# Altium schematic sheet PowerModule.SchDoc: CAN Current Loop Module - Power
size A4; Author: Pablo R Nava; DrawnBy: Pablo R Nava; Engineer: Pablo R Nava
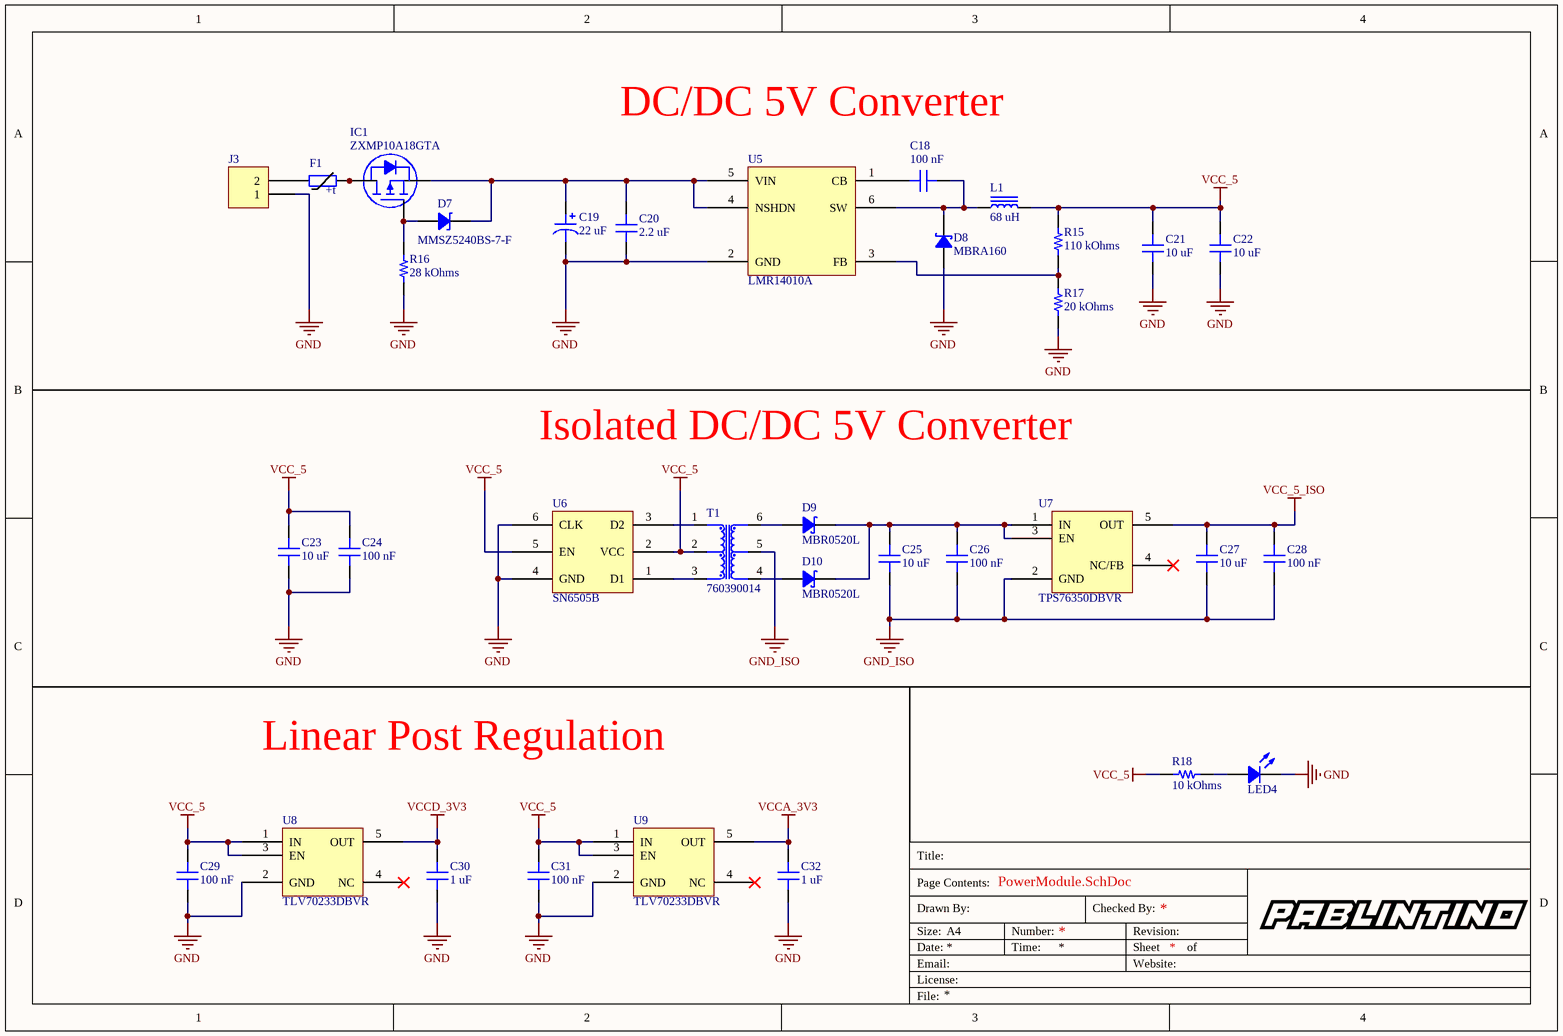
[diagram p0: PowerModule.SchDoc]

## Parts
C18  100 nF  [CAP 0805_2012]
C19  22 uF  [CAP ALSMD 6.3MM H7.7MM]
C20  2.2 uF  [CAP 1206_3216 - 1.8MM]
C21  10 uF  [CAP 1206_3216 - 1.8MM]
C22  10 uF  [CAP 1206_3216 - 1.8MM]
C23  10 uF  [CAP 0805_2012]
C24  100 nF  [CAP 0805_2012]
C25  10 uF  [CAP 0805_2012]
C26  100 nF  [CAP 0805_2012]
C27  10 uF  [CAP 0805_2012]
C28  100 nF  [CAP 0603_1608]
C29  100 nF  [CAP 0603_1608]
C30  1 uF  [CAP 0805_2012]
C31  100 nF  [CAP 0603_1608]
C32  1 uF  [CAP 0805_2012]
D7  MMSZ5240BS-7-F  [SOD-123]
D8  MBRA160  [DO214AC SMA]
D9  MBR0520L  [SOD-123]
D10  MBR0520L  [SOD-123]
F1  NANOASMDC012F-2  [PPTC_1206_1MM]  (value not drawn)
IC1  ZXMP10A18GTA  [DIODES SOT-223]
J3  1757475  [MSTBA2]  (value not drawn)
L1  68 uH  [SRR1210]
LED4  APTD1608LSECK  [LED 0603_1608 RED]  (value not drawn)
R15  110 kOhms  [RES 0805_2012]
R16  28 kOhms  [RES 0805_2012]
R17  20 kOhms  [RES 0805_2012]
R18  10 kOhms  [RES 0603_1608]
T1  760390014  [WE7603900XX]
U5  LMR14010A  [TI SOT-23-6 DDC]
U6  SN6505B  [TI SOT-23-6 DBV]
U7  TPS76350DBVR  [TI SOT-23-5 DBV]
U8  TLV70233DBVR  [TI SOT-23-5 DBV]
U9  TLV70233DBVR  [TI SOT-23-5 DBV]

## Nets
GND: C19.2 C20.2 C21.2 C22.2 C23.2 C24.2 C29.2 C30.2 C31.2 C32.2 D8.1 J3.1 LED4.2 R16.1 R17.2 U5.2(GND) U6.4(GND) U6.6(CLK) U8.2(GND) U9.2(GND)
GND_ISO: C25.2 C26.2 C27.2 C28.2 T1.5 U7.2(GND)
VCC_5: C21.1 C22.1 C23.1 C24.1 C29.1 C31.1 L1.2 R15.1 R18.1 T1.2 U6.2(VCC) U6.5(EN) U8.1(IN) U8.3(EN) U9.1(IN) U9.3(EN)
VCC_5_ISO: C27.1 C28.1 U7.5(OUT)
VCCA_3V3: C32.1 U9.5(OUT)
VCCD_3V3: C30.1 U8.5(OUT)
NetC18_1: C18.1 D8.2 L1.1 U5.6(SW)
NetC18_2: C18.2 U5.1(CB)
NetC19_1: C19.1 C20.1 D7.2 IC1.3(S) U5.4(NSHDN) U5.5(VIN)
NetC25_1: C25.1 C26.1 D9.2 D10.2 U7.1(IN) U7.3(EN)
NetD7_1: D7.1 IC1.1(G) R16.2
NetD9_1: D9.1 T1.6
NetD10_1: D10.1 T1.4
NetF1_1: F1.1 J3.2
NetF1_2: F1.2 IC1.2(D) IC1.4(D)
NetLED4_1: LED4.1 R18.2
NetR15_2: R15.2 R17.1 U5.3(FB)
NetT1_1: T1.1 U6.3(D2)
NetT1_3: T1.3 U6.1(D1)

Not connected (* = marked no-connect by the designer): U7 4(NC/FB)*; U8 4(NC)*; U9 4(NC)*

## Notes on the sheet
- DC/DC 5V Converter
- Isolated DC/DC 5V Converter
- Linear Post Regulation
- Title:
- Drawn By:
- Page Contents:
- Checked By:
- Size:
- Date:
- File:
- License:
- Email:
- A4
- Number:
- Time:
- Revision:
- Sheet
- Website:
- of
- (in symbol NANOASMDC012F-2) +t

## Library data of the parts
C18 = 08055C104K4Z2A: MLCC Ceramic 100 nF 50 V 10% Capacitor; Manufacturer: AVX; Voltage: 50 V; Type: capacitor_ceramic; Through Hole: 0; Part Number: 08055C104K4Z2A; Value: 100 nF; Tolerance: 10%; Composition: X7R; Created On: 30/05/2020 9:36:24; Updated On: 30/05/2020 9:36:39; Package: 0805 (2012 Metric)
C19 = HHXA630ARA220MF80G: Aluminum Electrolytic 22 uF 63 V 20% Capacitor; Manufacturer: United Chemi-Con; Voltage: 63 V; Material: aluminium; Polarised: 1; ESR: 80 mOhms; Lifetime Temperature: 4000 Hours @ 125 ºC; Minimum Temperature: 125 ºC; Maximum Temperature: -55 ºC; Type: capacitor_electrolytic; Through Hole: 0; Part Number: HHXA630ARA220MF80G; Value: 22 uF; Tolerance: 20%; Created On: 03/08/2020 11:19:58; Updated On: 03/08/2020 14:04:34; Package: SMD
C20 = 12065C225K4T2A: MLCC Ceramic 2.2 uF 50 V 10% Capacitor; Manufacturer: AVX; Voltage: 50 V; Type: capacitor_ceramic; Through Hole: 0; Part Number: 12065C225K4T2A; Value: 2.2 uF; Tolerance: 10%; Composition: X7R; Created On: 18/08/2020 12:44:20; Updated On: 18/08/2020 12:44:32; Package: 1206 (3216 Metric)
C21 C22 = 1206YC106KAT2A: MLCC Ceramic 10 uF 16 V 10% Capacitor; Manufacturer: AVX; Voltage: 16 V; Type: capacitor_ceramic; Through Hole: 0; Part Number: 1206YC106KAT2A; Value: 10 uF; Tolerance: 10%; Composition: X7R; Created On: 18/08/2020 12:31:56; Updated On: 18/08/2020 12:32:34; Package: 1206 (3216 Metric)
C23 C25 C27 = 0805YC106MAT2A: MLCC Ceramic 10 uF 25 V 20% Capacitor; Manufacturer: AVX; Voltage: 16 V; Type: capacitor_ceramic; Through Hole: 0; Part Number: 0805YC106MAT2A; Value: 10 uF; Tolerance: 20%; Composition: X7R; Created On: 22/06/2020 21:37:18; Updated On: 22/06/2020 21:37:31; Package: 0805 (2012 Metric)
C24 C26 = 0805YC104KAT4A: MLCC Ceramic 100 nF 16 v 10% Capacitor; Manufacturer: AVX; Voltage: 16 V; Type: capacitor_ceramic; Through Hole: 0; Part Number: 0805YC104KAT4A; Value: 100 nF; Tolerance: 10%; Composition: X7R; Created On: 21/05/2020 21:26:42; Updated On: 21/05/2020 21:29:08; Package: 0805 (2012 Metric)
C28 C29 C31 = 0603YC104KAT2A: MLCC Ceramic 100 nF 16 V 10% Capacitor; Manufacturer: AVX; Voltage: 16 V; Type: capacitor_ceramic; Through Hole: 0; Part Number: 0603YC104KAT2A; Value: 100 nF; Tolerance: 10%; Composition: X7R; Created On: 22/07/2020 19:09:12; Updated On: 22/07/2020 19:10:15; Package: 0603 (1608 Metric)
C30 C32 = 0805YC105KAT4A: MLCC Ceramic 1 uF 16 V 10% Capacitor; Manufacturer: AVX; Voltage: 16 V; Type: capacitor_ceramic; Through Hole: 0; Part Number: 0805YC105KAT4A; Value: 1 uF; Tolerance: 10%; Composition: X7R; Created On: 18/07/2020 20:46:26; Updated On: 18/07/2020 20:46:47; Package: 0805 (2012 Metric)
D7 = MMSZ5240BS-7-F: Zener 200 mW 10 V; Manufacturer: Diodes Incorporated; Maximum Power: 200 mW; Forward Voltage: 0.9 V; Zener Voltage: 10 V; Type: diode_zener; Through Hole: 0; Part Number: MMSZ5240BS-7-F; Created On: 19/07/2020 12:49:44; Updated On: 19/07/2020 13:00:21; Package: SOD-323-2
D8 = MBRA160: Schottky Rectifier Diode; Manufacturer: ON Semiconductor; Forward Voltage: 0.510 V; Reverse Leakage Current: 0.2 mA; Maximum Forward Avg. Current: 1 A; Maximum Repetitive Reverse Voltage: 60 V; Type: diode_rectifier; Through Hole: 0; Part Number: MBRA160; Diode Type: schottky; Created On: 02/08/2020 21:52:05; Updated On: 02/08/2020 21:57:57; Package: SMA 403D
D9 D10 = MBR0520L: Schottky Rectifier Diode; Manufacturer: ON Semiconductor; Forward Voltage: 0.385 V; Reverse Leakage Current: 8 mA; Maximum Forward Avg. Current: 500 mA; Maximum Repetitive Reverse Voltage: 20 V; Type: diode_rectifier; Through Hole: 0; Part Number: MBR0520L; Diode Type: schottky; Created On: 02/08/2020 21:34:39; Updated On: 02/08/2020 21:35:15; Package: SOD-123
F1 = NANOASMDC012F-2: PPTC .12A 48V Nano SMD AEC-Q200; Manufacturer: Littelfuse; Hold Current: 120 mA; Trip Current: 390 mA; Maximum Resistance: 1.5 Ohms; Minimum Resistance: 6.5 Ohms; Power Rating: 500 mW; Current Rating: 10 A; Type: fuse_pptc; Through Hole: 0; Part Number: NANOASMDC012F-2; Voltage Rating: 48 V; Created On: 07/08/2020 10:13:16; Updated On: 18/08/2020 22:26:58; Package: 1206 (3216 Metric)
IC1 = ZXMP10A18GTA: MOSFET 100V P-Chnl UMOS; Manufacturer: Diodes Incorporated; Drain Source Resistance: 150 mOhms; Gate Source Max Voltage: 20 V; Gate Source Threshold Voltage: 2 V; Drain Source Max Current: 3.7 A; Maximum Power: 3.9 W; Channel Type: P-Channel; Through Hole: 0; Part Number: ZXMP10A18GTA; Drain Source Max Voltage: 100 V; Created On: 19/07/2020 8:37:51; Updated On: 19/07/2020 11:20:23; Type: transistor_mosfet; Package: SOT-223-4
J3 = 1757475: Pluggable Terminal Blocks 2 Pos 5mm pitch Through Hole Header; Manufacturer: Phoenix Contact; Voltage Rating: 250 V; Current Rating: 12 A; Number of Contacts: 2; Through Hole: 1; LatestRevisionDate: 17-Jul-2002; LatestRevisionNote: Re-released for DXP Platform.; Publisher: Altium Limited; Part Number: 1757475; Orientation: right; Pitch: 5 mm; Number of Rows: 1; Created On: 18/07/2020 15:45:14; Updated On: 18/07/2020 15:45:51; Type: connector_pcb; Package: Through Hole
L1 = SRR1210-680M: Shielded SMD Power Inductor 68 uH 3 A; Manufacturer: Bourns; Resistance DCR: 102 mOhms; Test Frequency: 2.52 MHz; Current Rating: 3 A; Current Saturation: 2.7 A; Tolerance: 20%; Type: power_inductor; Through Hole: 0; Part Number: SRR1210-680M; Value: 68 uH; Created On: 02/08/2020 17:46:05; Updated On: 02/08/2020 21:10:00; Package: SRR1210
LED4 = APTD1608LSECK: SMD Low Current Red LED; Manufacturer: Kingbright; Gain Bandwith Product: 1.8 V; Input Type: dome; Amplifier Type: clear; Slew Rate: 625 nm; Voltage Supplies: 2 mA; Input Offset Voltage: 0.8 mm x 1.2 mm; Type: led_indicator; Through Hole: 0; Part Number: APTD1608LSECK; Output Type: red; Created On: 28/07/2020 18:43:03; Updated On: 28/07/2020 18:43:38; Package: 0603 (1608 Metric)
R15 = CRCW0805110KFKEAC: Thin Film Resistor 110 kOhms 1%; Manufacturer: Vishay / Dale; Power Max: 125 mW; Through Hole: 0; Part Number: CRCW0805110KFKEAC; Value: 110 kOhms; Tolerance: 1%; Created On: 18/08/2020 11:17:49; Updated On: 18/08/2020 11:18:12; Type: resistor; Package: 0805 (2012 Metric)
R16 = CRCW080528K0FKEA: Thin Film Resistor 28 kOhms 1%; Manufacturer: Vishay / Dale; Power Max: 125 mW; Through Hole: 0; Part Number: CRCW080528K0FKEA; Value: 28 kOhms; Tolerance: 1%; Created On: 19/07/2020 13:06:42; Updated On: 19/07/2020 13:07:02; Type: resistor; Package: 0805 (2012 Metric)
R17 = CRCW080520K0FKEAC: Thin Film Resistor 20 kOhms 1%; Manufacturer: Vishay / Dale; Power Max: 125 mW; Through Hole: 0; Part Number: CRCW080520K0FKEAC; Value: 20 kOhms; Tolerance: 1%; Created On: 18/08/2020 11:20:59; Updated On: 18/08/2020 11:21:05; Type: resistor; Package: 0805 (2012 Metric)
R18 = CRCW060310K0FKEAC: Thin Film Resistor 10 kOhms 1%; Manufacturer: Vishay / Dale; Power Max: 100 mW; Through Hole: 0; Part Number: CRCW060310K0FKEAC; Value: 10 kOhms; Tolerance: 1%; Created On: 22/07/2020 22:08:22; Updated On: 22/07/2020 22:09:01; Type: resistor; Package: 0603 (1608 Metric)
T1 = 760390014: MID-PPTI Push-Pull Transformer for TI SN650X; Manufacturer: Würth Elektronik; Number of Windings: 2; Primary DCR: 0.31 Ohms; Secondary DCR: 0.37 Ohms; Primary Inductance: 475 uH; Secondary Current Rating: 0.35 A; Primary Voltage Rating: 5 V; NPS Turns Ratio: 1:1.3; Through Hole: 0; Part Number: 760390014; Secondary Voltage Rating: 5 V; Created On: 18/08/2020 10:06:14; Updated On: 18/08/2020 10:09:43; Type: transformer; Package: 76039XXXX; Minimum Operating Temperature: -40 ªC; Maximum Operating Temperature: 125 ªC
U5 = LMR14010A: 4-V to 40-V, 1-A Step-Down Converter With High Efficiency Eco-mode; Manufacturer: Texas Instruments; Minimum Input Voltage: 4 V; Maximum Output Voltage: 40 V; Output Current: 1 A; Switching Frequency: 700 kHz; Topology: buck; Output Type: TBD; Number of Outputs: 1; Through Hole: 0; Part Number: LMR14010A; Created On: 02/08/2020 17:31:43; Updated On: 02/08/2020 21:12:40; Type: voltage_regulator_dcdc; Package: SOT-23-6
U6 = SN6505B: Low-Noise 1-A Transformer Drivers for Isolated Power Supplies; Manufacturer: Texas Instruments; Minimum Input Voltage: 3 V; Maximum Output Voltage: 5.5 V; Output Current: 1 A; Switching Frequency: 420 kHz; Topology: push-pull; Output Type: TBD; Number of Outputs: 1; Through Hole: 0; Part Number: SN6505B; Created On: 02/08/2020 17:34:18; Updated On: 02/08/2020 21:12:17; Type: voltage_regulator_dcdc; Package: SOT-23-6
U7 = TPS76350DBVR: Low-Power, 150-mA, Low-Dropout Linear Regulator; Manufacturer: Texas Instruments; Minimum/Fixed Output Voltage: 5 V; Output Current: 150 mA; Maximum Supply Current: 100 uA; Maximum Dropout Voltage: 225 mV; PSSR: 60 dB @ 1 kHz; Output Type: fixed; Through Hole: 0; Part Number: TPS76350DBVR; Maximum Output Voltage: 5 V; Created On: 02/08/2020 22:14:03; Updated On: 02/08/2020 22:19:56; Type: voltage_regulator_linear; Package: SOT-23-5
U8 U9 = TLV70233DBVR: TLV702 300-mA, Low-IQ, Low-Dropout Regulator; Manufacturer: Texas Instruments; Minimum/Fixed Output Voltage: 3.3 V; Output Current: 300 mA; Maximum Supply Current: 35 uA; Maximum Dropout Voltage: 375 mV; PSSR: 68 dB @ 1 kHz; Output Type: fixed; Through Hole: 0; Part Number: TLV70233DBVR; Maximum Output Voltage: 3.3 V; Created On: 21/07/2020 22:25:25; Updated On: 21/07/2020 22:25:46; Type: voltage_regulator_linear; Package: SOT-23-5